# Altium schematic sheet Title.SchDoc
size B; DocumentNumber: 1; SheetNumber: 1; SheetTotal: 7; ENG_APP_DATE: --/--/--; DSN_APP_DATE: --/--/--; CHK_APP_DATE: --/--/--
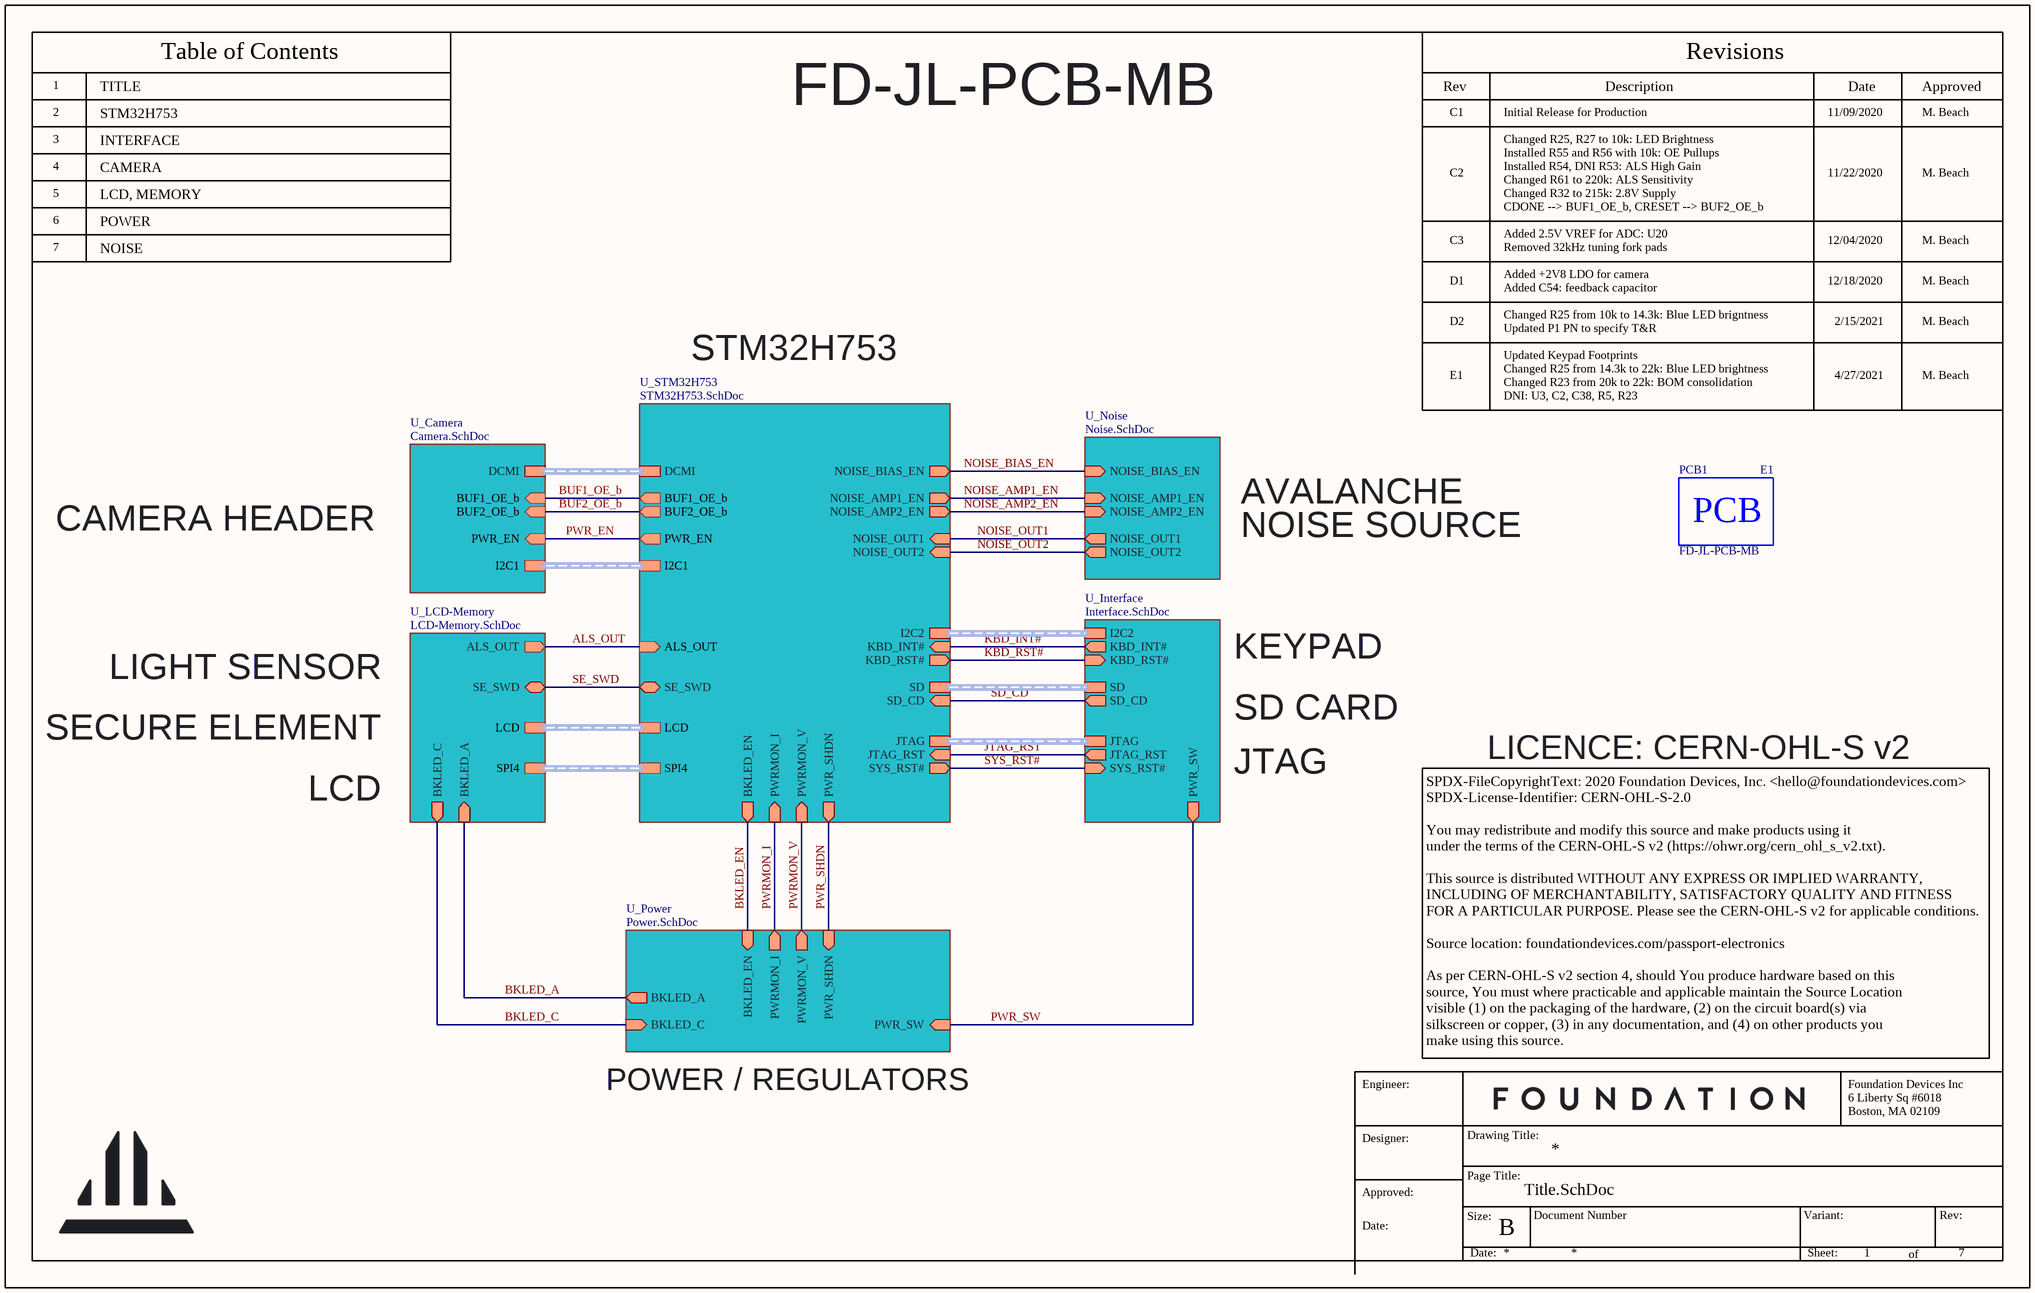
[diagram p0: Title.SchDoc]

## Parts
PCB1  FD-JL-PCB-MB  Rev: E1  (mechanical)

## Sub-sheets
U_Camera = Camera.SchDoc: DCMI (harness DCMI), BUF2_OE_b (in), PWR_EN (in), BUF1_OE_b (in), I2C1 (harness I2C)
U_Interface = Interface.SchDoc: I2C2 (harness I2C), KBD_INT# (out), SD (harness SD_Card), JTAG (harness JTAG), KBD_RST# (in), SD_CD (out), JTAG_RST (out), PWR_SW (out), SYS_RST# (in)
U_LCD-Memory = LCD-Memory.SchDoc: BKLED_A (in), BKLED_C (out), SE_SWD (bidir), ALS_OUT (out), LCD (harness LCD), SPI4 (harness SPI)
U_Noise = Noise.SchDoc: NOISE_OUT1 (out), NOISE_AMP2_EN (in), NOISE_BIAS_EN (in), NOISE_OUT2 (out), NOISE_AMP1_EN (in)
U_Power = Power.SchDoc: BKLED_A (out), BKLED_C (in), BKLED_EN (in), PWR_SHDN (in), PWR_SW (in), PWRMON_I (out), PWRMON_V (out)
U_STM32H753 = STM32H753.SchDoc: SD (harness SD_Card), KBD_INT# (in), I2C2 (harness I2C), JTAG (harness JTAG), DCMI (harness DCMI), KBD_RST# (out), SE_SWD (bidir), BKLED_EN (out), SD_CD (in), JTAG_RST (in), PWR_SHDN (out), SYS_RST# (out), NOISE_BIAS_EN (out), NOISE_AMP1_EN (out), NOISE_AMP2_EN (out), NOISE_OUT1 (in), NOISE_OUT2 (in), PWRMON_I (in), PWRMON_V (in), BUF2_OE_b (out), PWR_EN (out), BUF1_OE_b (out), LCD (harness LCD), I2C1 (harness I2C), SPI4 (harness SPI), ALS_OUT (in)

## Nets
ALS_OUT: sheet U_STM32H753/ALS_OUT, sheet U_LCD-Memory/ALS_OUT
BKLED_A: sheet U_LCD-Memory/BKLED_A, sheet U_Power/BKLED_A
BKLED_C: sheet U_LCD-Memory/BKLED_C, sheet U_Power/BKLED_C
BKLED_EN: sheet U_STM32H753/BKLED_EN, sheet U_Power/BKLED_EN
BUF1_OE_b: sheet U_STM32H753/BUF1_OE_b, sheet U_Camera/BUF1_OE_b
BUF2_OE_b: sheet U_STM32H753/BUF2_OE_b, sheet U_Camera/BUF2_OE_b
JTAG_RST: sheet U_STM32H753/JTAG_RST, sheet U_Interface/JTAG_RST
KBD_INT#: sheet U_STM32H753/KBD_INT#, sheet U_Interface/KBD_INT#
KBD_RST#: sheet U_STM32H753/KBD_RST#, sheet U_Interface/KBD_RST#
NOISE_AMP1_EN: sheet U_STM32H753/NOISE_AMP1_EN, sheet U_Noise/NOISE_AMP1_EN
NOISE_AMP2_EN: sheet U_STM32H753/NOISE_AMP2_EN, sheet U_Noise/NOISE_AMP2_EN
NOISE_BIAS_EN: sheet U_STM32H753/NOISE_BIAS_EN, sheet U_Noise/NOISE_BIAS_EN
NOISE_OUT1: sheet U_STM32H753/NOISE_OUT1, sheet U_Noise/NOISE_OUT1
NOISE_OUT2: sheet U_STM32H753/NOISE_OUT2, sheet U_Noise/NOISE_OUT2
PWR_EN: sheet U_STM32H753/PWR_EN, sheet U_Camera/PWR_EN
PWR_SHDN: sheet U_STM32H753/PWR_SHDN, sheet U_Power/PWR_SHDN
PWR_SW: sheet U_Interface/PWR_SW, sheet U_Power/PWR_SW
PWRMON_I: sheet U_STM32H753/PWRMON_I, sheet U_Power/PWRMON_I
PWRMON_V: sheet U_STM32H753/PWRMON_V, sheet U_Power/PWRMON_V
SD_CD: sheet U_STM32H753/SD_CD, sheet U_Interface/SD_CD
SE_SWD: sheet U_STM32H753/SE_SWD, sheet U_LCD-Memory/SE_SWD
SYS_RST#: sheet U_STM32H753/SYS_RST#, sheet U_Interface/SYS_RST#

## Buses and harness runs
harness sheet U_Camera/DCMI = sheet U_STM32H753/DCMI
harness sheet U_Camera/I2C1 = sheet U_STM32H753/I2C1
harness sheet U_Interface/I2C2 = sheet U_STM32H753/I2C2
harness sheet U_Interface/JTAG = sheet U_STM32H753/JTAG
harness sheet U_Interface/SD = sheet U_STM32H753/SD
harness sheet U_LCD-Memory/LCD = sheet U_STM32H753/LCD
harness sheet U_LCD-Memory/SPI4 = sheet U_STM32H753/SPI4

## Notes on the sheet
- TITLE
- 2
- 3
- STM32H753
- INTERFACE
- CAMERA
- FD-JL-PCB-MB
- C1
- Initial Release for Production
- Changed R25, R27 to 10k: LED Brightness
- Installed R55 and R56 with 10k: OE Pullups
- 11/09/2020
- M. Beach
- 4
- 5
- 6
- LCD, MEMORY
- POWER
- C2
- CDONE --> BUF1_OE_b, CRESET --> BUF2_OE_b
- Installed R54, DNI R53: ALS High Gain
- Changed R61 to 220k: ALS Sensitivity
- Changed R32 to 215k: 2.8V Supply
- Added 2.5V VREF for ADC: U20
- 11/22/2020
- 7
- NOISE
- C3
- D1
- Removed 32kHz tuning fork pads
- Added +2V8 LDO for camera
- Added C54: feedback capacitor
- 12/04/2020
- 12/18/2020
- D2
- Changed R25 from 10k to 14.3k: Blue LED brigntness
- Updated P1 PN to specify T&R
- Updated Keypad Footprints
- Changed R25 from 14.3k to 22k: Blue LED brightness
- 2/15/2021
- E1
- DNI: U3, C2, C38, R5, R23
- Changed R23 from 20k to 22k: BOM consolidation
- 4/27/2021
- AVALANCHE
- CAMERA HEADER
- NOISE SOURCE
- KEYPAD
- LIGHT SENSOR
- SD CARD
- SECURE ELEMENT
- JTAG
- LICENCE: CERN-OHL-S v2
- LCD
- POWER / REGULATORS
- SPDX-FileCopyrightText: 2020 Foundation Devices, Inc. <hello@foundationdevices.com>
  SPDX-License-Identifier: CERN-OHL-S-2.0
  You may redistribute and modify this source and make products using it
  under the terms of the CERN-OHL-S v2 (https://ohwr.org/cern_ohl_s_v2.txt).
  This source is distributed WITHOUT ANY EXPRESS OR IMPLIED WARRANTY,
  INCLUDING OF MERCHANTABILITY, SATISFACTORY QUALITY AND FITNESS
  FOR A PARTICULAR PURPOSE. Please see the CERN-OHL-S v2 for applicable conditions.
  Source location: foundationdevices.com/passport-electronics
  As per CERN-OHL-S v2 section 4, should You produce hardware based on this
  source, You must where practicable and applicable maintain the Source Location
  visible (1) on the packaging of the hardware, (2) on the circuit board(s) via
  silkscreen or copper, (3) in any documentation, and (4) on other products you
  make using this source.
- 1
- Table of Contents
- Rev
- Description
- Revisions
- Date
- Approved
- Engineer:
- Foundation Devices Inc
- 6 Liberty Sq #6018
- Designer:
- Drawing Title:
- Page Title:
- Boston, MA 02109
- Approved:
- Date:
- Size:
- B
- Document Number
- Variant:
- Rev:
- Sheet:
- of

## Library data of the parts
PCB1 = CMP-MISC-00002-5: PCB - Juliet - Main Board